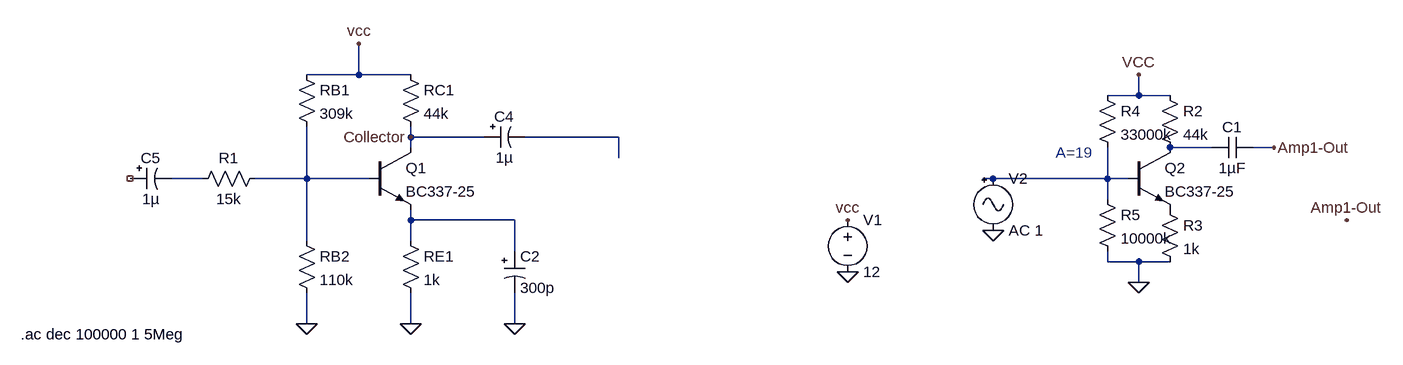
[diagram p0: schematic Draft5.asc]
Draft5.asc, the LTspice schematic file:
Version 4
SHEET 1 1676 680
WIRE 80 48 80 0
WIRE 80 48 0 48
WIRE 160 48 80 48
WIRE 1280 80 1280 48
WIRE 1280 80 1232 80
WIRE 1328 80 1280 80
WIRE 160 144 160 128
WIRE 272 144 160 144
WIRE 480 144 336 144
WIRE 160 160 160 144
WIRE 1392 160 1328 160
WIRE 1488 160 1456 160
WIRE 480 176 480 144
WIRE -160 208 -208 208
WIRE 0 208 0 128
WIRE 0 208 -80 208
WIRE 96 208 0 208
WIRE 1056 208 1040 208
WIRE 1232 208 1232 160
WIRE 1232 208 1056 208
WIRE 1264 208 1232 208
WIRE 1232 240 1232 208
WIRE 160 272 160 256
WIRE 320 272 160 272
WIRE 0 304 0 208
WIRE 160 304 160 272
WIRE 320 320 320 272
WIRE 1232 336 1232 320
WIRE 1280 336 1232 336
WIRE 1328 336 1280 336
WIRE 1280 368 1280 336
WIRE 0 432 0 384
WIRE 160 432 160 384
WIRE 320 432 320 384
FLAG 80 0 vcc
FLAG 832 272 vcc
FLAG 832 352 0
FLAG 320 432 0
FLAG 160 432 0
FLAG 0 432 0
FLAG 160 144 Collector
FLAG 1056 288 0
FLAG 1280 368 0
FLAG 1280 48 VCC
FLAG 1488 160 Amp1-Out
FLAG 1600 272 Amp1-Out
SYMBOL res -16 32 R0
SYMATTR InstName RB1
SYMATTR Value 309k
SYMBOL res 144 32 R0
SYMATTR InstName RC1
SYMATTR Value 44k
SYMBOL res 144 288 R0
SYMATTR InstName RE1
SYMATTR Value 1k
SYMBOL res -16 288 R0
SYMATTR InstName RB2
SYMATTR Value 110k
SYMBOL polcap 304 320 R0
SYMATTR InstName C2
SYMATTR Value 300p
SYMBOL voltage 832 256 R0
WINDOW 123 0 0 Left 0
WINDOW 39 0 0 Left 0
SYMATTR InstName V1
SYMATTR Value 12
SYMBOL npn 96 160 R0
SYMATTR InstName Q1
SYMATTR Value BC337-25
SYMBOL res -64 192 R90
WINDOW 0 0 56 VBottom 2
WINDOW 3 32 56 VTop 2
SYMATTR InstName R1
SYMATTR Value 15k
SYMBOL polcap 272 128 M90
WINDOW 0 0 32 VBottom 2
WINDOW 3 32 32 VTop 2
SYMATTR InstName C4
SYMATTR Value 1µ
SYMBOL polcap -272 192 M90
WINDOW 0 0 32 VBottom 2
WINDOW 3 32 32 VTop 2
SYMATTR InstName C5
SYMATTR Value 1µ
SYMBOL Misc\\signal 1056 192 R0
SYMATTR InstName V2
SYMATTR Value AC 1
SYMBOL npn 1264 160 R0
SYMATTR InstName Q2
SYMATTR Value BC337-25
SYMBOL res 1312 64 R0
SYMATTR InstName R2
SYMATTR Value 44k
SYMBOL res 1312 240 R0
SYMATTR InstName R3
SYMATTR Value 1k
SYMBOL res 1216 64 R0
SYMATTR InstName R4
SYMATTR Value 33000k
SYMBOL res 1216 224 R0
SYMATTR InstName R5
SYMATTR Value 10000k
SYMBOL cap 1456 144 R90
WINDOW 0 0 32 VBottom 2
WINDOW 3 32 32 VTop 2
SYMATTR InstName C1
SYMATTR Value 1µF
TEXT -440 448 Left 2 !.ac dec 100000 1 5Meg
TEXT 1152 168 Left 2 ;A=19

The netlist it stands for:
* Draft5.asc
RB1 vcc N004 309k
RC1 vcc Collector 44k
RE1 N006 0 1k
RB2 N004 0 110k
C2 N006 0 300p
V1 vcc 0 12
Q1 Collector N004 N006 0 BC337-25
R1 N004 N003 15k
C4 Collector N001 1µ
C5 NC_01 N003 1µ
V2 N005 0 AC 1
Q2 N002 N005 P001 0 BC337-25
R2 vcc N002 44k
R3 P001 0 1k
R4 vcc N005 33000k
R5 N005 0 10000k
C1 Amp1-Out N002 1µF
.model NPN NPN
.model PNP PNP
.lib standard.bjt
.ac dec 100000 1 5Meg
* A=19
.backanno
.end